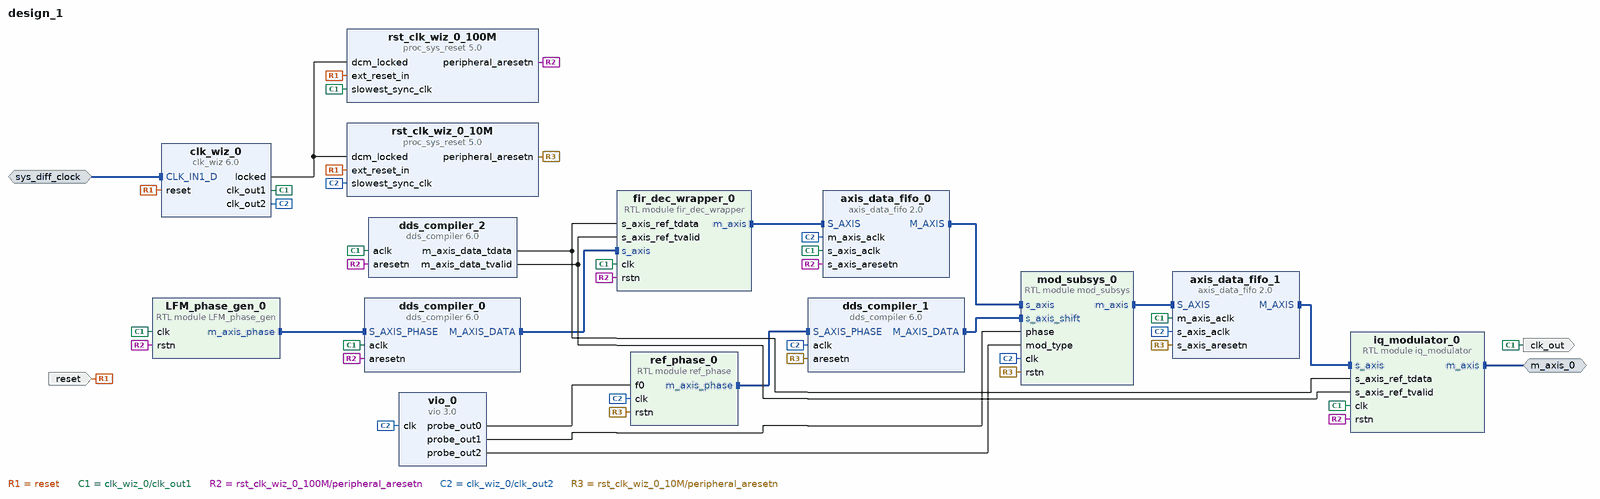
[diagram p0: block diagram of the top level]
# Vivado block design design_1, xc7z045ffg900-2, Vivado 2019.1.2
create_bd_design design_1

create_bd_intf_port -mode Slave -vlnv xilinx.com:interface:diff_clock_rtl:1.0 sys_diff_clock
set_property -dict {CONFIG.FREQ_HZ 200000000} [get_bd_intf_ports sys_diff_clock]
create_bd_intf_port -mode Master -vlnv xilinx.com:interface:axis_rtl:1.0 m_axis_0
set_property -dict {CONFIG.PHASE 0.0} [get_bd_intf_ports m_axis_0]
create_bd_port -dir I -type rst reset
set_property -dict {CONFIG.POLARITY ACTIVE_HIGH} [get_bd_ports reset]
create_bd_port -dir O -type clk clk_out

create_bd_cell -type ip -vlnv xilinx.com:ip:dds_compiler:6.0 dds_compiler_0
set_property -dict [list \
  CONFIG.DATA_Has_TLAST Not_Required \
  CONFIG.Has_ARESETn true \
  CONFIG.Has_Phase_Out false \
  CONFIG.M_DATA_Has_TUSER Not_Required \
  CONFIG.Noise_Shaping None \
  CONFIG.Output_Frequency1 0 \
  CONFIG.Output_Selection Cosine \
  CONFIG.Output_Width 8 \
  CONFIG.PINC1 0 \
  CONFIG.Parameter_Entry Hardware_Parameters \
  CONFIG.Phase_Increment Streaming \
  CONFIG.Phase_Width 16 \
  CONFIG.S_PHASE_Has_TUSER Not_Required \
] [get_bd_cells dds_compiler_0]
create_bd_cell -type ip -vlnv xilinx.com:ip:dds_compiler:6.0 dds_compiler_1
set_property -dict [list \
  CONFIG.DATA_Has_TLAST Not_Required \
  CONFIG.DDS_Clock_Rate 10 \
  CONFIG.Frequency_Resolution 0.4 \
  CONFIG.Has_ARESETn true \
  CONFIG.Has_Phase_Out false \
  CONFIG.M_DATA_Has_TUSER Not_Required \
  CONFIG.Negative_Sine true \
  CONFIG.Noise_Shaping None \
  CONFIG.Output_Frequency1 0 \
  CONFIG.Output_Width 8 \
  CONFIG.PINC1 0 \
  CONFIG.Parameter_Entry Hardware_Parameters \
  CONFIG.Phase_Increment Streaming \
  CONFIG.Phase_Width 16 \
  CONFIG.S_PHASE_Has_TUSER Not_Required \
] [get_bd_cells dds_compiler_1]
create_bd_cell -type ip -vlnv xilinx.com:ip:dds_compiler:6.0 dds_compiler_2
set_property -dict [list \
  CONFIG.Has_ARESETn true \
  CONFIG.Has_Phase_Out false \
  CONFIG.M_DATA_Has_TUSER Not_Required \
  CONFIG.Noise_Shaping None \
  CONFIG.Output_Frequency1 0 \
  CONFIG.Output_Width 8 \
  CONFIG.PINC1 0100110011001101 \
  CONFIG.Parameter_Entry Hardware_Parameters \
  CONFIG.Phase_Width 16 \
] [get_bd_cells dds_compiler_2]
create_bd_cell -type ip -vlnv xilinx.com:ip:axis_data_fifo:2.0 axis_data_fifo_0
set_property -dict {CONFIG.IS_ACLK_ASYNC 1} [get_bd_cells axis_data_fifo_0]
create_bd_cell -type ip -vlnv xilinx.com:ip:axis_data_fifo:2.0 axis_data_fifo_1
set_property -dict {CONFIG.IS_ACLK_ASYNC 1} [get_bd_cells axis_data_fifo_1]
create_bd_cell -type ip -vlnv xilinx.com:ip:clk_wiz:6.0 clk_wiz_0
set_property -dict [list \
  CONFIG.CLKOUT2_JITTER 178.053 \
  CONFIG.CLKOUT2_PHASE_ERROR 89.971 \
  CONFIG.CLKOUT2_REQUESTED_OUT_FREQ 10.000 \
  CONFIG.CLKOUT2_USED true \
  CONFIG.CLK_IN1_BOARD_INTERFACE sys_diff_clock \
  CONFIG.MMCM_CLKOUT1_DIVIDE 100 \
  CONFIG.NUM_OUT_CLKS 2 \
  CONFIG.RESET_BOARD_INTERFACE reset \
  CONFIG.USE_BOARD_FLOW true \
] [get_bd_cells clk_wiz_0]
create_bd_cell -type module -reference LFM_phase_gen LFM_phase_gen_0
create_bd_cell -type module -reference fir_dec_wrapper fir_dec_wrapper_0
set_property -dict [list \
  CONFIG.DECIMATE 10 \
  CONFIG.MEM_FILE D:/work/radar_course/lesson_7/vivado/zc706_sim/zc706_sim.srcs/sources_1/imports/hdl/coef_lp_dec.mem \
] [get_bd_cells fir_dec_wrapper_0]
create_bd_cell -type module -reference iq_modulator iq_modulator_0
set_property -dict [list \
  CONFIG.D_W 24 \
  CONFIG.MEM_FILE D:/work/radar_course/lesson_7/vivado/zc706_sim/zc706_sim.srcs/sources_1/imports/hdl/coef_lp_int.mem \
] [get_bd_cells iq_modulator_0]
create_bd_cell -type module -reference mod_subsys mod_subsys_0
create_bd_cell -type ip -vlnv xilinx.com:ip:proc_sys_reset:5.0 rst_clk_wiz_0_100M
create_bd_cell -type ip -vlnv xilinx.com:ip:proc_sys_reset:5.0 rst_clk_wiz_0_10M
create_bd_cell -type ip -vlnv xilinx.com:ip:vio:3.0 vio_0
set_property -dict [list \
  CONFIG.C_NUM_PROBE_IN 0 \
  CONFIG.C_NUM_PROBE_OUT 3 \
  CONFIG.C_PROBE_OUT0_WIDTH 32 \
  CONFIG.C_PROBE_OUT1_INIT_VAL 0x64 \
  CONFIG.C_PROBE_OUT1_WIDTH 8 \
  CONFIG.C_PROBE_OUT2_INIT_VAL 0x1 \
  CONFIG.C_PROBE_OUT2_WIDTH 2 \
] [get_bd_cells vio_0]
create_bd_cell -type module -reference ref_phase ref_phase_0

# ---- connections ----

connect_bd_intf_net [get_bd_intf_ports m_axis_0] [get_bd_intf_pins iq_modulator_0/m_axis]
connect_bd_intf_net [get_bd_intf_pins dds_compiler_0/M_AXIS_DATA] [get_bd_intf_pins fir_dec_wrapper_0/s_axis]
connect_bd_intf_net [get_bd_intf_pins dds_compiler_1/S_AXIS_PHASE] [get_bd_intf_pins ref_phase_0/m_axis_phase]
connect_bd_intf_net [get_bd_intf_ports sys_diff_clock] [get_bd_intf_pins clk_wiz_0/CLK_IN1_D]
connect_bd_intf_net [get_bd_intf_pins LFM_phase_gen_0/m_axis_phase] [get_bd_intf_pins dds_compiler_0/S_AXIS_PHASE]
connect_bd_intf_net [get_bd_intf_pins axis_data_fifo_0/M_AXIS] [get_bd_intf_pins mod_subsys_0/s_axis]
connect_bd_intf_net [get_bd_intf_pins mod_subsys_0/m_axis] [get_bd_intf_pins axis_data_fifo_1/S_AXIS]
connect_bd_intf_net [get_bd_intf_pins dds_compiler_1/M_AXIS_DATA] [get_bd_intf_pins mod_subsys_0/s_axis_shift]
connect_bd_intf_net [get_bd_intf_pins fir_dec_wrapper_0/m_axis] [get_bd_intf_pins axis_data_fifo_0/S_AXIS]
connect_bd_intf_net [get_bd_intf_pins axis_data_fifo_1/M_AXIS] [get_bd_intf_pins iq_modulator_0/s_axis]
connect_bd_net [get_bd_ports reset] \
  [get_bd_pins clk_wiz_0/reset] [get_bd_pins rst_clk_wiz_0_100M/ext_reset_in] [get_bd_pins rst_clk_wiz_0_10M/ext_reset_in]
connect_bd_net [get_bd_pins clk_wiz_0/clk_out1] \
  [get_bd_pins LFM_phase_gen_0/clk] [get_bd_pins dds_compiler_0/aclk] [get_bd_pins fir_dec_wrapper_0/clk] \
  [get_bd_pins axis_data_fifo_0/s_axis_aclk] [get_bd_pins rst_clk_wiz_0_100M/slowest_sync_clk] \
  [get_bd_pins dds_compiler_2/aclk] [get_bd_pins axis_data_fifo_1/m_axis_aclk] [get_bd_pins iq_modulator_0/clk] \
  [get_bd_ports clk_out]
connect_bd_net [get_bd_pins clk_wiz_0/locked] [get_bd_pins rst_clk_wiz_0_100M/dcm_locked] [get_bd_pins rst_clk_wiz_0_10M/dcm_locked]
connect_bd_net [get_bd_pins rst_clk_wiz_0_100M/peripheral_aresetn] \
  [get_bd_pins axis_data_fifo_0/s_axis_aresetn] [get_bd_pins LFM_phase_gen_0/rstn] [get_bd_pins dds_compiler_0/aresetn] \
  [get_bd_pins fir_dec_wrapper_0/rstn] [get_bd_pins dds_compiler_2/aresetn] [get_bd_pins iq_modulator_0/rstn]
connect_bd_net [get_bd_pins clk_wiz_0/clk_out2] \
  [get_bd_pins axis_data_fifo_0/m_axis_aclk] [get_bd_pins mod_subsys_0/clk] [get_bd_pins rst_clk_wiz_0_10M/slowest_sync_clk] \
  [get_bd_pins dds_compiler_1/aclk] [get_bd_pins axis_data_fifo_1/s_axis_aclk] [get_bd_pins vio_0/clk] \
  [get_bd_pins ref_phase_0/clk]
connect_bd_net [get_bd_pins rst_clk_wiz_0_10M/peripheral_aresetn] \
  [get_bd_pins mod_subsys_0/rstn] [get_bd_pins dds_compiler_1/aresetn] [get_bd_pins axis_data_fifo_1/s_axis_aresetn] \
  [get_bd_pins ref_phase_0/rstn]
connect_bd_net [get_bd_pins dds_compiler_2/m_axis_data_tdata] \
  [get_bd_pins fir_dec_wrapper_0/s_axis_ref_tdata] [get_bd_pins iq_modulator_0/s_axis_ref_tdata]
connect_bd_net [get_bd_pins dds_compiler_2/m_axis_data_tvalid] \
  [get_bd_pins fir_dec_wrapper_0/s_axis_ref_tvalid] [get_bd_pins iq_modulator_0/s_axis_ref_tvalid]
connect_bd_net [get_bd_pins vio_0/probe_out0] [get_bd_pins ref_phase_0/f0]
connect_bd_net [get_bd_pins vio_0/probe_out1] [get_bd_pins mod_subsys_0/phase]
connect_bd_net [get_bd_pins vio_0/probe_out2] [get_bd_pins mod_subsys_0/mod_type]

validate_bd_design
save_bd_design
